# EAGLE schematic testSchematic (EAGLE 9.6.2)

## Sheet 1 of 2
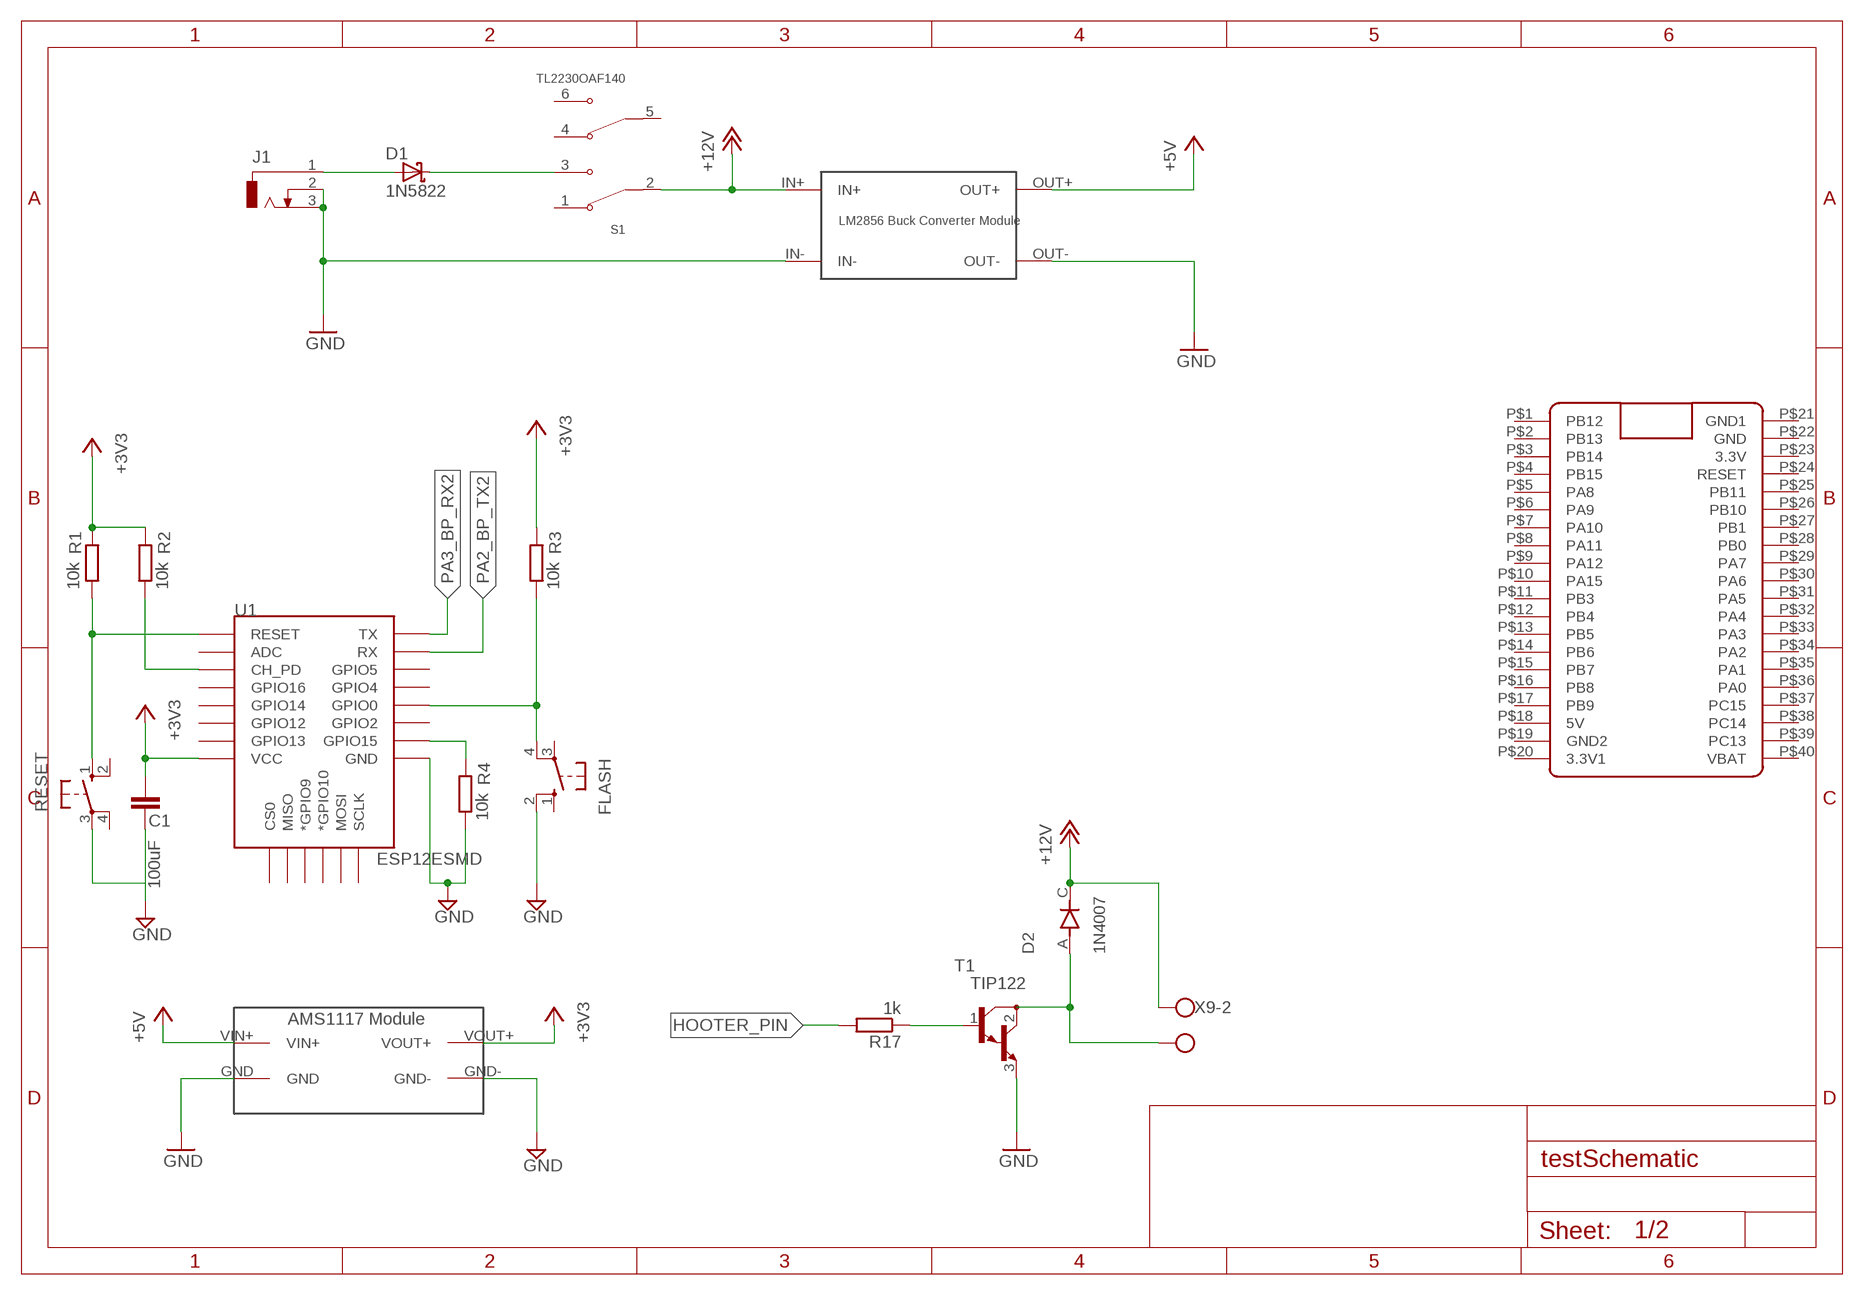
[diagram p0: schematic, sheet 1]

### Parts
C1  100uF  C2,5-3  [C2.5-3]
D1  1N5822  [DIOAD2120W130L950D530P]
D2  1N4007  [DIOAD1060W80L520D270]
FLASH  10-XX  [B3F-10XX]
J1  DCJ0303  [DCJ0303]
R1  10k  R-EU_0207/10  [0207/10]
R2  10k  R-EU_0207/10  [0207/10]
R3  10k  R-EU_0207/10  [0207/10]
R4  10k  R-EU_0207/10  [0207/10]
R17  1k  R-EU_0204/7  [0204/7]
RESET  10-XX  [B3F-10XX]
S1  TL2230OAF140  [SW_TL2230OAF140]
T1  TIP122  [TO220]
U1  ESP12ESMD  [ESP12E-SMD]
U$1  BLUE_PILL  [BLUE_PILL]
U$2  LM2596_MODULELM2569_MODULE  [LM2596_MODULE]
U$3  AMS1117_MODULE  [AMS1117_MODULE]
X9  W237-102  [W237-102]

### Nets
+3V3: C1.2 R1.2 R2.2 R3.2 U1.VCC U$3.VOUT+ ; also sheet 2
+5V: U$2.OUT+ U$3.VIN+
+12V: D2.C S1.2(COM1) U$2.IN+ X9.2 ; also sheet 2
GND: C1.1 FLASH.2(S1) J1.2 J1.3 R4.1 RESET.3(P) T1.3(E) U1.GND U$2.IN- U$2.OUT- U$3.GND U$3.GND- ; also sheet 2
HOOTER_PIN: R17.2
N$1: D1.A J1.1
N$2: D1.C S1.3(NO1)
N$3: R1.1 RESET.1(S) U1.RESET
N$4: R2.1 U1.CH_PD
N$5: R4.2 U1.GPIO15
N$6: FLASH.4(P1) R3.1 U1.GPIO0
N$18: R17.1 T1.1(B)
N$19: D2.A T1.2(C) X9.1
PA2_BP_TX2: U1.RXD0(RX)
PA3_BP_RX2: U1.TXD0(TX)
Unconnected: FLASH.1(S) FLASH.3(P) RESET.2(S1) RESET.4(P1) S1.1(NC1) S1.4(NC2) S1.5(COM2) S1.6(NO2) U1.ADC U1.CS0 U1.GPIO2 U1.GPIO4 U1.GPIO5 U1.GPIO9(*GPIO9) U1.GPIO10(*GPIO10) U1.GPIO12 U1.GPIO13 U1.GPIO14 U1.GPIO16 U1.MISO U1.MOSI U1.SCLK U$1.P$1(PB12) U$1.P$2(PB13) U$1.P$3(PB14) U$1.P$4(PB15) U$1.P$5(PA8) U$1.P$6(PA9) U$1.P$7(PA10) U$1.P$8(PA11) U$1.P$9(PA12) U$1.P$10(PA15) U$1.P$11(PB3) U$1.P$12(PB4) U$1.P$13(PB5) U$1.P$14(PB6) U$1.P$15(PB7) U$1.P$16(PB8) U$1.P$17(PB9) U$1.P$18(5V) U$1.P$19(GND2) U$1.P$20(3.3V1) U$1.P$22(GND) U$1.P$23(3.3V) U$1.P$24(RESET) U$1.P$25(PB11) U$1.P$26(PB10) U$1.P$27(PB1) U$1.P$28(PB0) U$1.P$29(PA7) U$1.P$30(PA6) U$1.P$31(PA5) U$1.P$32(PA4) U$1.P$33(PA3) U$1.P$34(PA2) U$1.P$35(PA1) U$1.P$36(PA0) U$1.P$37(PC15) U$1.P$38(PC14) U$1.P$39(PC13) U$1.P$40(VBAT)

## Sheet 2 of 2
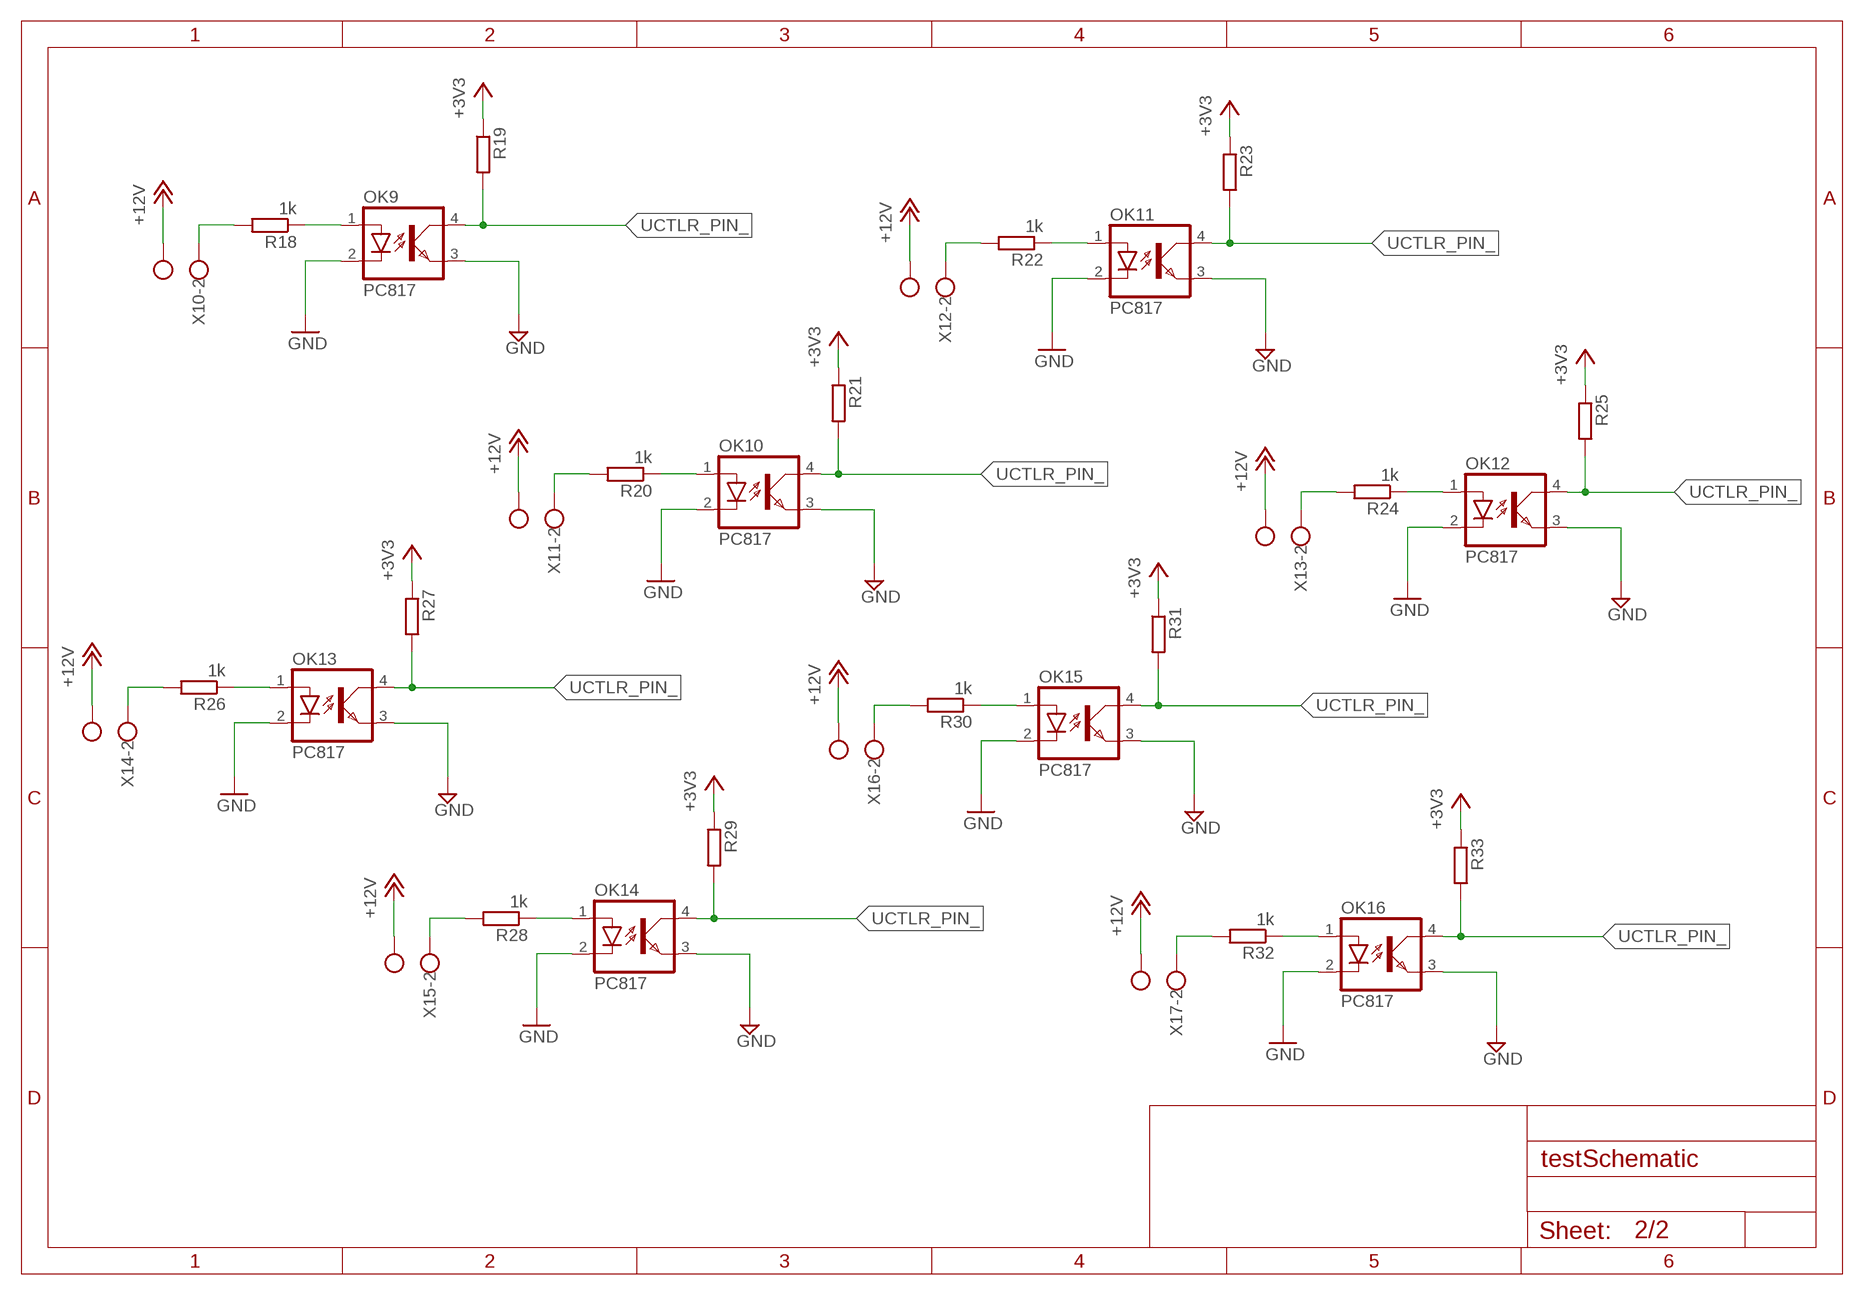
[diagram p1: schematic, sheet 2]

### Parts
OK9  PC817  [DIL04]
OK10  PC817  [DIL04]
OK11  PC817  [DIL04]
OK12  PC817  [DIL04]
OK13  PC817  [DIL04]
OK14  PC817  [DIL04]
OK15  PC817  [DIL04]
OK16  PC817  [DIL04]
R18  1k  R-EU_0204/7  [0204/7]
R19  R-EU_0204/7  [0204/7]
R20  1k  R-EU_0204/7  [0204/7]
R21  R-EU_0204/7  [0204/7]
R22  1k  R-EU_0204/7  [0204/7]
R23  R-EU_0204/7  [0204/7]
R24  1k  R-EU_0204/7  [0204/7]
R25  R-EU_0204/7  [0204/7]
R26  1k  R-EU_0204/7  [0204/7]
R27  R-EU_0204/7  [0204/7]
R28  1k  R-EU_0204/7  [0204/7]
R29  R-EU_0204/7  [0204/7]
R30  1k  R-EU_0204/7  [0204/7]
R31  R-EU_0204/7  [0204/7]
R32  1k  R-EU_0204/7  [0204/7]
R33  R-EU_0204/7  [0204/7]
X10  W237-102  [W237-102]
X11  W237-102  [W237-102]
X12  W237-102  [W237-102]
X13  W237-102  [W237-102]
X14  W237-102  [W237-102]
X15  W237-102  [W237-102]
X16  W237-102  [W237-102]
X17  W237-102  [W237-102]

### Nets
+3V3: R19.1 R21.1 R23.1 R25.1 R27.1 R29.1 R31.1 R33.1 ; also sheet 1
+12V: X10.1 X11.1 X12.1 X13.1 X14.1 X15.1 X16.1 X17.1 ; also sheet 1
GND: OK9.2(C) OK9.3(EMIT) OK10.2(C) OK10.3(EMIT) OK11.2(C) OK11.3(EMIT) OK12.2(C) OK12.3(EMIT) OK13.2(C) OK13.3(EMIT) OK14.2(C) OK14.3(EMIT) OK15.2(C) OK15.3(EMIT) OK16.2(C) OK16.3(EMIT) ; also sheet 1
N$21: OK9.1(A) R18.1
N$22: R18.2 X10.2
N$23: OK10.1(A) R20.1
N$24: R20.2 X11.2
N$25: OK11.1(A) R22.1
N$26: R22.2 X12.2
N$27: OK12.1(A) R24.1
N$28: R24.2 X13.2
N$29: OK13.1(A) R26.1
N$30: R26.2 X14.2
N$31: OK14.1(A) R28.1
N$32: R28.2 X15.2
N$33: OK15.1(A) R30.1
N$34: R30.2 X16.2
N$35: OK16.1(A) R32.1
N$36: R32.2 X17.2
UCTLR_PIN_: OK9.4(COL) OK10.4(COL) OK11.4(COL) OK12.4(COL) OK13.4(COL) OK14.4(COL) OK15.4(COL) OK16.4(COL) R19.2 R21.2 R23.2 R25.2 R27.2 R29.2 R31.2 R33.2

## Power pins joined to a net without a drawn wire
GND1: U$1.P$21(GND1)

## Library data of the parts
C1 = capacitor-wima:C: CAPACITOR naming: grid - package width
D1 = 1N5822:1N5822: 1N5822 Series 40 V 3 A Through Hole Schottky Rectifier - DO-201AD Check availability <https://pricing.snapeda.com/parts/1N5822/ON%20Semiconductor/view-part?ref=eda>; AVAILABILITY: Not in stock; CHECK_PRICES: https://www.snapeda.com/parts/1N5822/Onsemi/view-part/?ref=eda; DESCRIPTION: Diode; Diode Type:Schottky; Repetitive Reverse Voltage Max, Vrrm:40V; Forward Current, If(AV):3A; Forward Surge Current Max, Ifsm:80A; Forward Voltage Max, VF:0.525V; Junction Temperature, Tj max:125°C ;RoHS Compliant: Yes; MF: ON Semiconductor; MP: 1N5822; PACKAGE: AXIAL LEAD-2 ON Semiconductor; PRICE: None; SNAPEDA_LINK: https://www.snapeda.com/parts/1N5822/Onsemi/view-part/?ref=snap
D2 = 1N4007:1N4007: Diode Switching 1KV 1A 2-Pin DO-41 Check availability <https://pricing.snapeda.com/parts/1N4007/ON%20Semiconductor/view-part?ref=eda>; AVAILABILITY: In Stock; CHECK_PRICES: https://www.snapeda.com/parts/1N4007/Onsemi/view-part/?ref=eda; DESCRIPTION: Diode Standard 1000V 1A Through Hole DO-204AL (DO-41); MF: ON Semiconductor; MP: 1N4007; PACKAGE: DO-41-2 ON Semiconductor; PRICE: None; SNAPEDA_LINK: https://www.snapeda.com/parts/1N4007/Onsemi/view-part/?ref=snap
FLASH RESET = switch-omron:10-XX: OMRON SWITCH; MPN: B3F-1000; OC_FARNELL: 176432; OC_NEWARK: 36M3542
J1 = con-jack:DCJ0303: DC POWER JACK Source: DCJ0303.pdf; OC_FARNELL: unknown; OC_NEWARK: unknown
OK9-OK16 = optocoupler:PC817: SHARP OPTO COUPLER; MPN: PC817X4J000F; OC_FARNELL: 9707727; OC_NEWARK: 97K7059
R1-R4 R17-R33 = rcl:R-EU_: RESISTOR, European symbol; SPICEPREFIX: R
S1 = TL2230OAF140 switch:TL2230OAF140: Check availability <https://pricing.snapeda.com/parts/TL2230OAF140/E-Switch/view-part?ref=eda>; AVAILABILITY: In Stock; CHECK_PRICES: https://www.snapeda.com/parts/TL2230OAF140/E-Switch/view-part/?ref=eda; DESCRIPTION: Pushbutton Switch DPDT Standard Through Hole; MF: E-Switch; MP: TL2230OAF140; PACKAGE: None; PRICE: None; PURCHASE-URL: https://pricing.snapeda.com/search?q=TL2230OAF140&ref=eda; SNAPEDA_LINK: https://www.snapeda.com/parts/TL2230OAF140/E-Switch/view-part/?ref=snap
T1 = TIP122:TIP122: NPN BIPOLAR DARLINGTON TRANSISTOR Check availability <https://pricing.snapeda.com/parts/TIP122/onsemi/view-part?ref=eda>; AVAILABILITY: In Stock; CHECK_PRICES: https://www.snapeda.com/parts/TIP122/EMI/view-part/?ref=eda; DESCRIPTION: Bipolar (BJT) Transistor NPN - Darlington 100 V 5 A - 2 W Through Hole TO-220; MF: onsemi; MP: TIP122; PACKAGE: TO-220-3 ON Semiconductor; PRICE: None; PURCHASE-URL: https://pricing.snapeda.com/search?q=TIP122&ref=eda; SNAPEDA_LINK: https://www.snapeda.com/parts/TIP122/EMI/view-part/?ref=snap
U1 = ESP12E:ESP12E: ESP12E Module Check availability <https://pricing.snapeda.com/parts/ESP-12E/AI-Thinker/view-part?ref=eda>; AVAILABILITY: Not in stock; CHECK_PRICES: https://www.snapeda.com/parts/ESP-12E/AI-Thinker/view-part/?ref=eda; DESCRIPTION: FLEXYPIN ADAPTER - ESP-07/ESP-12; MF: AI-Thinker; MP: ESP-12E; PACKAGE: Package; PRICE: None; SNAPEDA_LINK: https://www.snapeda.com/parts/ESP-12E/AI-Thinker/view-part/?ref=snap
U$1 = BluePill:BLUE_PILL
U$2 = buck:LM2596_MODULE
U$3 = AMS1117_Module:AMS1117_MODULE
X9-X17 = con-wago-500:W237-102: WAGO SCREW CLAMP; MPN: 237-102; OC_FARNELL: unknown; OC_NEWARK: 70K9898